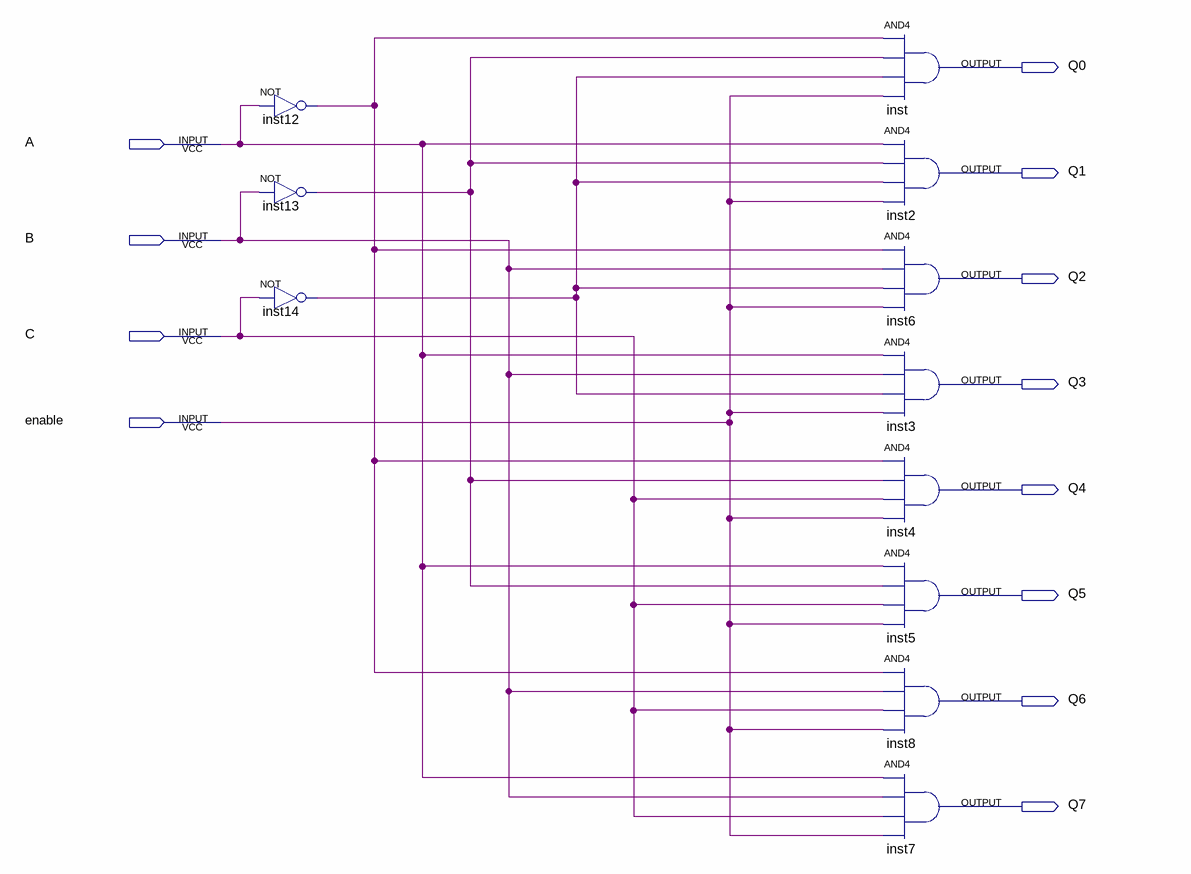
[diagram p0: schematic sheet]
// Quartus schematic 1131417_Lab1-1.bdf as structural Verilog: 11 symbols, 12 pins
module \1131417_Lab1-1  (
  input  A,
  input  B,
  input  C,
  input  enable,
  output Q0,
  output Q1,
  output Q2,
  output Q3,
  output Q4,
  output Q5,
  output Q6,
  output Q7
);

  wire inst12_out, inst13_out, inst14_out;

  not inst12 (inst12_out, A);
  not inst13 (inst13_out, B);
  not inst14 (inst14_out, C);
  and inst (Q0, inst12_out, inst13_out, inst14_out, enable);
  and inst2 (Q1, A, inst13_out, inst14_out, enable);
  and inst6 (Q2, inst12_out, B, inst14_out, enable);
  and inst3 (Q3, A, B, inst14_out, enable);
  and inst4 (Q4, inst12_out, inst13_out, C, enable);
  and inst5 (Q5, A, inst13_out, C, enable);
  and inst8 (Q6, inst12_out, B, C, enable);
  and inst7 (Q7, A, B, C, enable);
endmodule
